# EAGLE schematic Smart power box (EAGLE 6.6.0)
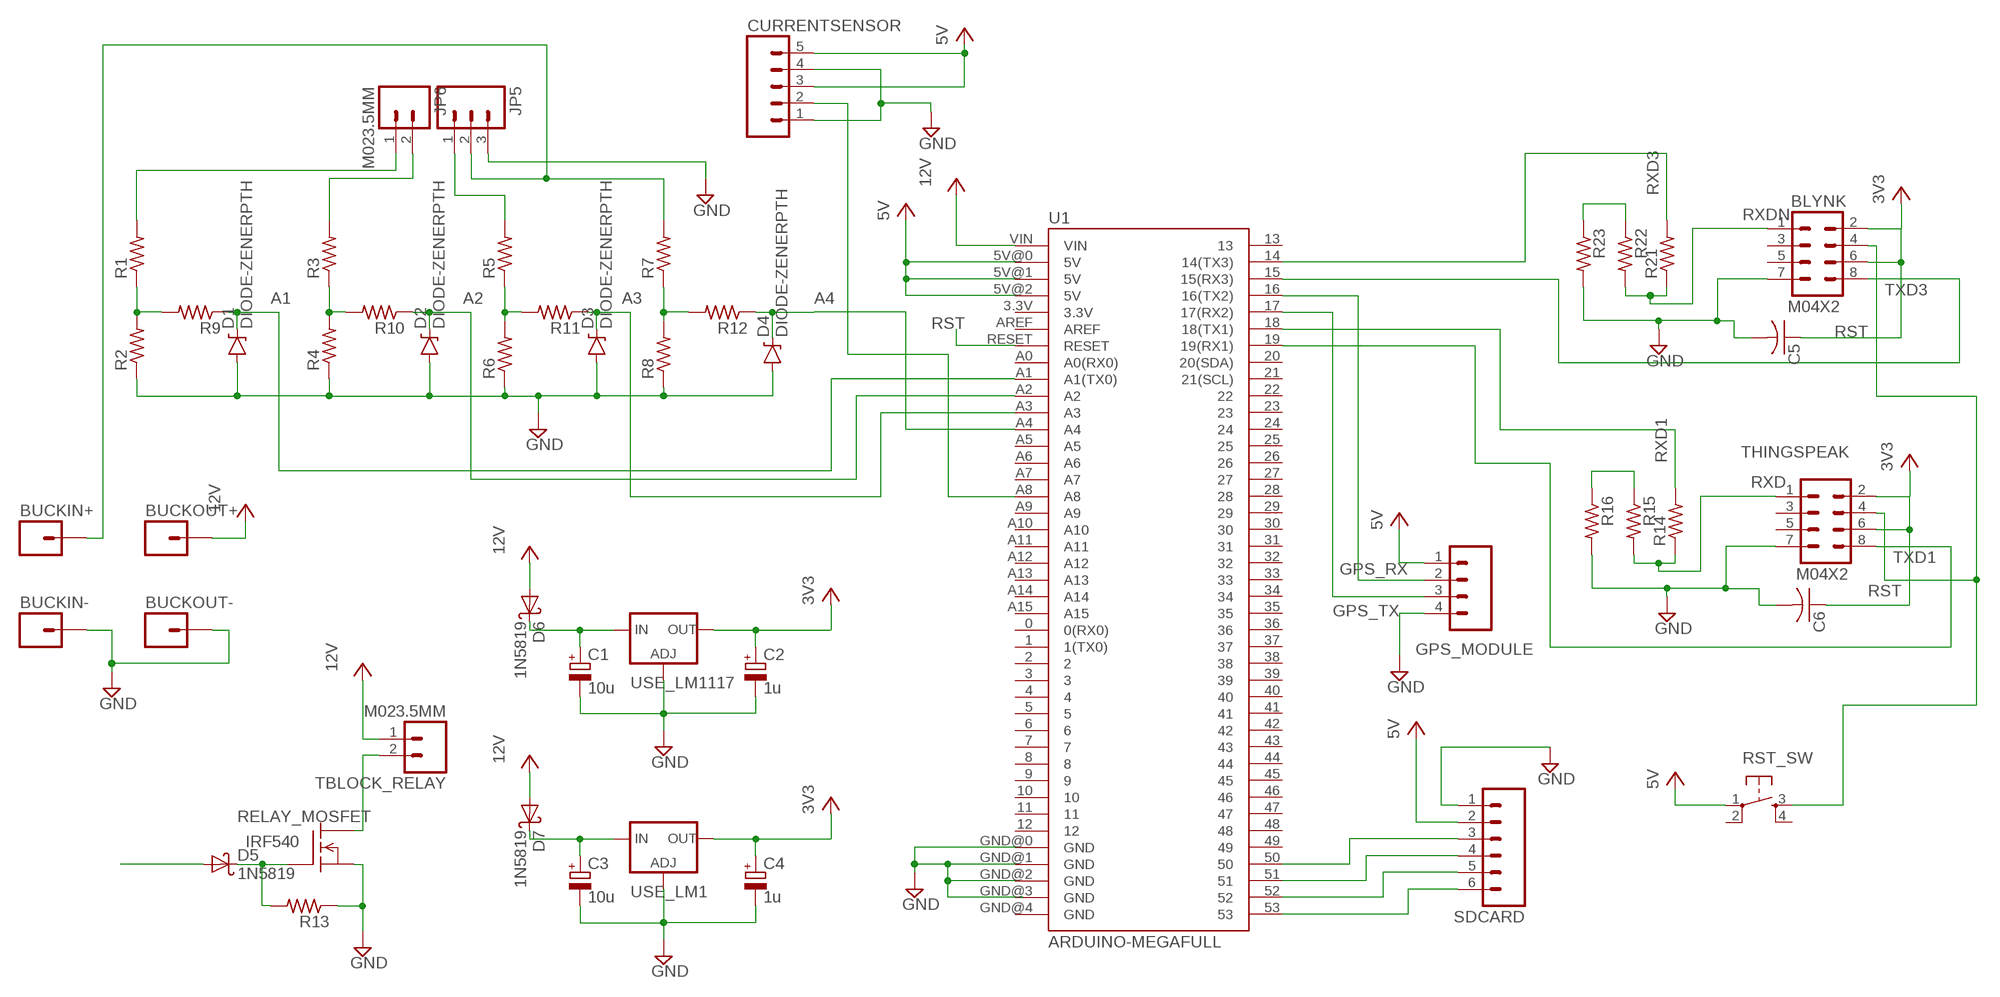
[diagram p0: schematic, sheet 1]

## Parts
BLYNK  M04X2  [2X4]
BUCKIN+  M01NOSILK-KIT  [1X01NS-KIT]
BUCKIN-  M01NOSILK-KIT  [1X01NS-KIT]
BUCKOUT+  M01NOSILK-KIT  [1X01NS-KIT]
BUCKOUT-  M01NOSILK-KIT  [1X01NS-KIT]
C1  10u  CPOL-EUE2.5-6  [E2,5-6]
C2  1u  CPOL-EUE2.5-6  [E2,5-6]
C3  10u  CPOL-EUE2.5-6  [E2,5-6]
C4  1u  CPOL-EUE2.5-6  [E2,5-6]
C5  C-US025-024X044  [C025-024X044]
C6  C-US025-024X044  [C025-024X044]
CURRENTSENSOR  M05JST-VERT  [JST-5-PTH-VERT]
D1  DIODE-ZENERPTH  [DIODE-ZENER]
D2  DIODE-ZENERPTH  [DIODE-ZENER]
D3  DIODE-ZENERPTH  [DIODE-ZENER]
D4  DIODE-ZENERPTH  [DIODE-ZENER]
D5  1N5819  [DO41-10]
D6  1N5819  [DO41-10]
D7  1N5819  [DO41-10]
GPS_MODULE  M04PTH  [1X04]
JP5  M03SCREW  [SCREWTERMINAL-3.5MM-3]
JP6  M023.5MM  [SCREWTERMINAL-3.5MM-2]
R1  R-US_0207/15  [0207/15]
R2  R-US_0207/15  [0207/15]
R3  R-US_0207/15  [0207/15]
R4  R-US_0207/15  [0207/15]
R5  R-US_0207/15  [0207/15]
R6  R-US_0207/15  [0207/15]
R7  R-US_0207/15  [0207/15]
R8  R-US_0207/15  [0207/15]
R9  R-US_0207/15  [0207/15]
R10  R-US_0207/15  [0207/15]
R11  R-US_0207/15  [0207/15]
R12  R-US_0207/15  [0207/15]
R13  R-US_0207/7  [0207/7]
R14  R-US_0207/7  [0207/7]
R15  R-US_0207/7  [0207/7]
R16  R-US_0207/7  [0207/7]
R21  R-US_0207/7  [0207/7]
R22  R-US_0207/7  [0207/7]
R23  R-US_0207/7  [0207/7]
RELAY_MOSFET  IRF540  [TO220]
RST_SW  OMRON_SWITCH_40-XX  [B3F-40XX]
SDCARD  M06SILK_FEMALE_PTH  [1X06]
TBLOCK_RELAY  M023.5MM  [SCREWTERMINAL-3.5MM-2]
THINGSPEAK  M04X2  [2X4]
U1  ARDUINO-MEGAFULL  [ARDUINO_MEGA]
USE_LM1  V_REG_317SINK  [TO220-ADJ]
USE_LM1117  V_REG_317SINK  [TO220-ADJ]

## Nets
A1: D1.P$1(C) R9.1 U1.A1(A1(TX0))
A2: D2.P$1(C) R10.1 U1.A2
A3: D3.P$1(C) R11.1 U1.A3
A4: D4.P$1(C) R12.1 U1.A4
GND: BLYNK.7 BUCKIN-.1 BUCKOUT-.1 C1.- C2.- C3.- C4.- C5.2 C6.2 CURRENTSENSOR.1 CURRENTSENSOR.4 D1.P$2(A) D2.P$2(A) D3.P$2(A) D4.P$2(A) GPS_MODULE.4 JP5.3 R2.1 R4.1 R6.1 R8.1 R13.1 R16.2 R23.2 RELAY_MOSFET.3(S) SDCARD.1 THINGSPEAK.7 U1.GND@0(GND) U1.GND@1(GND) U1.GND@2(GND) USE_LM1.ADJ USE_LM1117.ADJ
GPS_RX: GPS_MODULE.2 U1.16(16(TX2))
GPS_TX: GPS_MODULE.3 U1.17(17(RX2))
N$1: R1.1 R2.2 R9.2
N$2: R3.1 R4.2 R10.2
N$3: R5.1 R6.2 R11.2
N$4: R7.1 R8.2 R12.2
N$5: C1.+ D6.C USE_LM1117.IN
N$6: CURRENTSENSOR.2 U1.A8
N$7: SDCARD.3 U1.50
N$8: SDCARD.4 U1.51
N$9: JP6.1 R1.2
N$10: JP6.2 R3.2
N$11: JP5.1 R5.2
N$12: BUCKIN+.1 JP5.2 R7.2
N$13: RELAY_MOSFET.2(D) TBLOCK_RELAY.2
N$14: D5.C R13.2 RELAY_MOSFET.1(G)
N$15: D5.A
N$16: R15.1 R16.1
N$17: SDCARD.5 U1.52
N$18: SDCARD.6 U1.53
N$21: C3.+ D7.C USE_LM1.IN
N$25: R22.1 R23.1
RST: BLYNK.4 RST_SW.3(S) THINGSPEAK.4 U1.RESET
RXD: R14.1 R15.2 THINGSPEAK.1
RXD1: R14.2 U1.18(18(TX1))
RXD3: R21.2 U1.14(14(TX3))
RXDN: BLYNK.1 R21.1 R22.2
TXD1: THINGSPEAK.8 U1.19(19(RX1))
TXD3: BLYNK.8 U1.15(15(RX3))
VCC: BLYNK.2 BLYNK.6 BUCKOUT+.1 C2.+ C4.+ C5.1 C6.1 CURRENTSENSOR.3 CURRENTSENSOR.5 D6.A D7.A GPS_MODULE.1 RST_SW.1(P) SDCARD.2 TBLOCK_RELAY.1 THINGSPEAK.2 THINGSPEAK.6 U1.5V@0(5V) U1.5V@1(5V) U1.5V@2(5V) U1.VIN USE_LM1.OUT USE_LM1117.OUT ; supply symbol labelled 12V, 3V3, 5V
Unconnected: BLYNK.3 BLYNK.5 RST_SW.2(P1) RST_SW.4(S1) THINGSPEAK.3 THINGSPEAK.5 U1.0(0(RX0)) U1.1(1(TX0)) U1.2 U1.3 U1.3.3V U1.4 U1.5 U1.6 U1.7 U1.8 U1.9 U1.10 U1.11 U1.12 U1.13 U1.20(20(SDA)) U1.21(21(SCL)) U1.22 U1.23 U1.24 U1.25 U1.26 U1.27 U1.28 U1.29 U1.30 U1.31 U1.32 U1.33 U1.34 U1.35 U1.36 U1.37 U1.38 U1.39 U1.40 U1.41 U1.42 U1.43 U1.44 U1.45 U1.46 U1.47 U1.48 U1.49 U1.A0(A0(RX0)) U1.A5 U1.A6 U1.A7 U1.A9 U1.A10 U1.A11 U1.A12 U1.A13 U1.A14 U1.A15 U1.AREF U1.GND@3(GND) U1.GND@4(GND)

## Library data of the parts
BLYNK THINGSPEAK = SparkFun-Connectors:M04X2: .1" header, two rows of four.
BUCKIN+ BUCKIN- BUCKOUT+ BUCKOUT- = SparkFun-Connectors:M01: Header 1 Standard 1-pin 0.1" header. Use with straight break away headers (SKU : PRT-00116), right angle break away headers (PRT-00553), swiss pins (PRT-00743), machine pins (PRT-00117), and female headers (PRT-00115).
C1-C4 = rcl:CPOL-EU: POLARIZED CAPACITOR, European symbol
C5 C6 = rcl:C-US: CAPACITOR, American symbol
CURRENTSENSOR = SparkFun-Connectors:M05: Header 5 Standard 5-pin 0.1" header. Use with straight break away headers (SKU : PRT-00116), right angle break away headers (PRT-00553), swiss pins (PRT-00743), machine pins (PRT-00117), and female headers (PRT-00115). Molex polarized connector foot print use with SKU : PRT-08230 with associated crimp pins and housings.
D1-D4 = SparkFun-DiscreteSemi:DIODE-ZENER: Zener Diode Production Part - 8199 3.4V Zener Voltage
D5-D7 = CEDT_JANUARY_2015_v5:1N5819: DIODE general purpose rectifier, 1 A
GPS_MODULE = SparkFun-Connectors:M04: Header 4 Standard 4-pin 0.1" header. Use with straight break away headers (SKU : PRT-00116), right angle break away headers (PRT-00553), swiss pins (PRT-00743), machine pins (PRT-00117), and female headers (PRT-00115). Molex polarized connector foot print use with SKU : PRT-08231 with associated crimp pins and housings. 1MM SMD Version SKU: PRT-10208
JP5 = SparkFun-Connectors:M03: Header 3 Standard 3-pin 0.1" header. Use with straight break away headers (SKU : PRT-00116), right angle break away headers (PRT-00553), swiss pins (PRT-00743), machine pins (PRT-00117), and female headers (PRT-00115). Molex polarized connector foot print use with SKU : PRT-08232 with associated crimp pins and housings.
JP6 TBLOCK_RELAY = SparkFun-Connectors:M02: Standard 2-pin 0.1" header. Use with - straight break away headers ( PRT-00116) - right angle break away headers (PRT-00553) - swiss pins (PRT-00743) - machine pins (PRT-00117) - female headers (PRT-00115) Molex polarized connector foot print use with: PRT-08233 with associated crimp pins and housings. 2.54_SCREWTERM for use with PRT-10571. 3.5mm Screw Terminal footprints for PRT-08084 5mm Screw Terminal footprints for use with PRT-08432
R1-R12 = resistor:R-US_: RESISTOR, American symbol
R13-R16 R21-R23 = rcl:R-US_: RESISTOR, American symbol
RELAY_MOSFET = transistor-fet:IRF540: N-Channel Enhancement MOSFET (HEXFET); 100V; 28A; 0,077Ohm
RST_SW = CEDT_JANUARY_2015_v5:OMRON_SWITCH
SDCARD = SparkFun-Connectors:M06: Header 6 Standard 6-pin 0.1" header. Use with straight break away headers (SKU : PRT-00116), right angle break away headers (PRT-00553), swiss pins (PRT-00743), machine pins (PRT-00117), and female headers (PRT-00115). Molex polarized connector foot print use with SKU : PRT-08094 with associated crimp pins and housings. NOTES ON THE VARIANTS LOCK and LOCK_LONGPADS... This footprint was designed to help hold the alignment of a through-hole component (i.e. 6-pin header) while soldering it into place. You may notice that each hole has been shifted either up or down by 0.005 of an inch from it's more standard position (which is a perfectly straight line). This slight alteration caused the pins (the squares in the middle) to touch the edges of the holes. Because they are alternating, it causes a "brace" to hold the component in place. 0.005 has proven to be the perfect amount of "off-center" position when using our standard breakaway headers. Although looks a little odd when you look at the bare footprint, once you have a header in there, the alteration is very hard to notice. Also,if you push a header all the way into place, it is covered up entirely on the bottom side. This idea of altering the position of holes to aid alignment will be further integrated into the Sparkfun Library for other footprints. It can help hold any component with 3 or more connection pins.; PROD_ID: CONN-08437
U1 = SparkFun-Boards:ARDUINO-MEGA: Arduino Mega board footprint
USE_LM1 USE_LM1117 = SparkFun-PowerIC:V_REG_317: Voltage Regulator Standard LM317 adjustable voltage regulator. AOI (Adjust Output Input). Google 'LM317 Calculator' for easy to use app to get the two resistor values needed. 240/720 for 5V output. 240/390 for 3.3V output. Spark Fun Electronics SKU : COM-00527